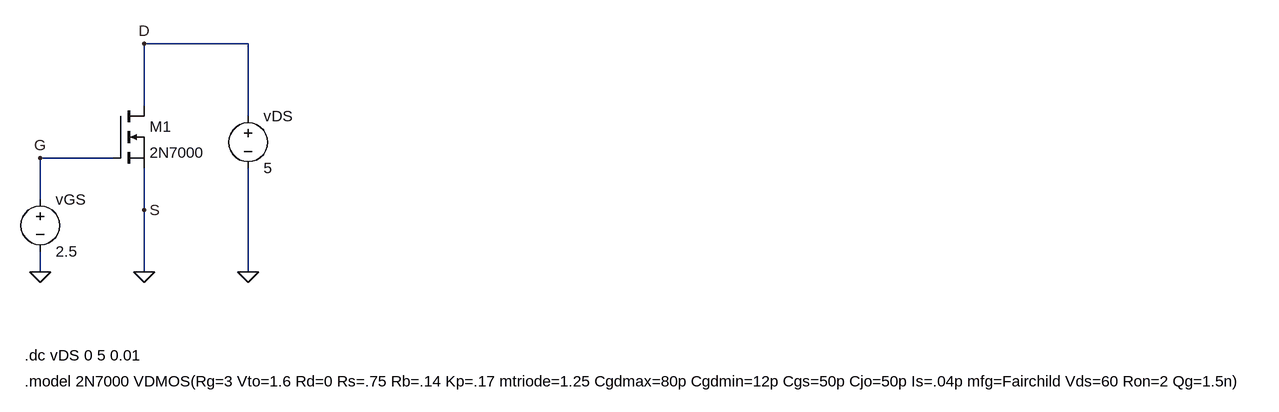
[diagram p0: schematic Lab9p1.asc]
Lab9p1.asc, the LTspice schematic file:
Version 4
SHEET 1 2108 680
WIRE 384 0 224 0
WIRE 224 96 224 0
WIRE 384 112 384 0
WIRE 176 176 64 176
WIRE 64 240 64 176
WIRE 224 256 224 192
WIRE 64 352 64 320
WIRE 224 352 224 256
WIRE 384 352 384 192
FLAG 224 352 0
FLAG 64 352 0
FLAG 384 352 0
FLAG 64 176 G
FLAG 224 0 D
FLAG 224 256 S
SYMBOL nmos 176 96 R0
SYMATTR InstName M1
SYMATTR Value 2N7000
SYMBOL voltage 64 224 R0
WINDOW 123 0 0 Left 0
WINDOW 39 0 0 Left 0
SYMATTR InstName vGS
SYMATTR Value 2.5
SYMBOL voltage 384 96 R0
WINDOW 123 0 0 Left 0
WINDOW 39 0 0 Left 0
SYMATTR InstName vDS
SYMATTR Value 5
TEXT 40 520 Left 2 !.model 2N7000 VDMOS(Rg=3 Vto=1.6 Rd=0 Rs=.75 Rb=.14 Kp=.17 mtriode=1.25 Cgdmax=80p Cgdmin=12p Cgs=50p Cjo=50p Is=.04p mfg=Fairchild Vds=60 Ron=2 Qg=1.5n)
TEXT 40 480 Left 2 !.dc vDS 0 5 0.01

The netlist it stands for:
* Lab9p1.asc
M1 D G 0 0 2N7000
vGS G 0 2.5
vDS D 0 5
.model NMOS NMOS
.model PMOS PMOS
.lib standard.mos
.model 2N7000 VDMOS(Rg=3 Vto=1.6 Rd=0 Rs=.75 Rb=.14 Kp=.17 mtriode=1.25 Cgdmax=80p Cgdmin=12p Cgs=50p Cjo=50p Is=.04p mfg=Fairchild Vds=60 Ron=2 Qg=1.5n)
.dc vDS 0 5 0.01
.backanno
.end